# EAGLE design schematic (EAGLE 9.3.0)
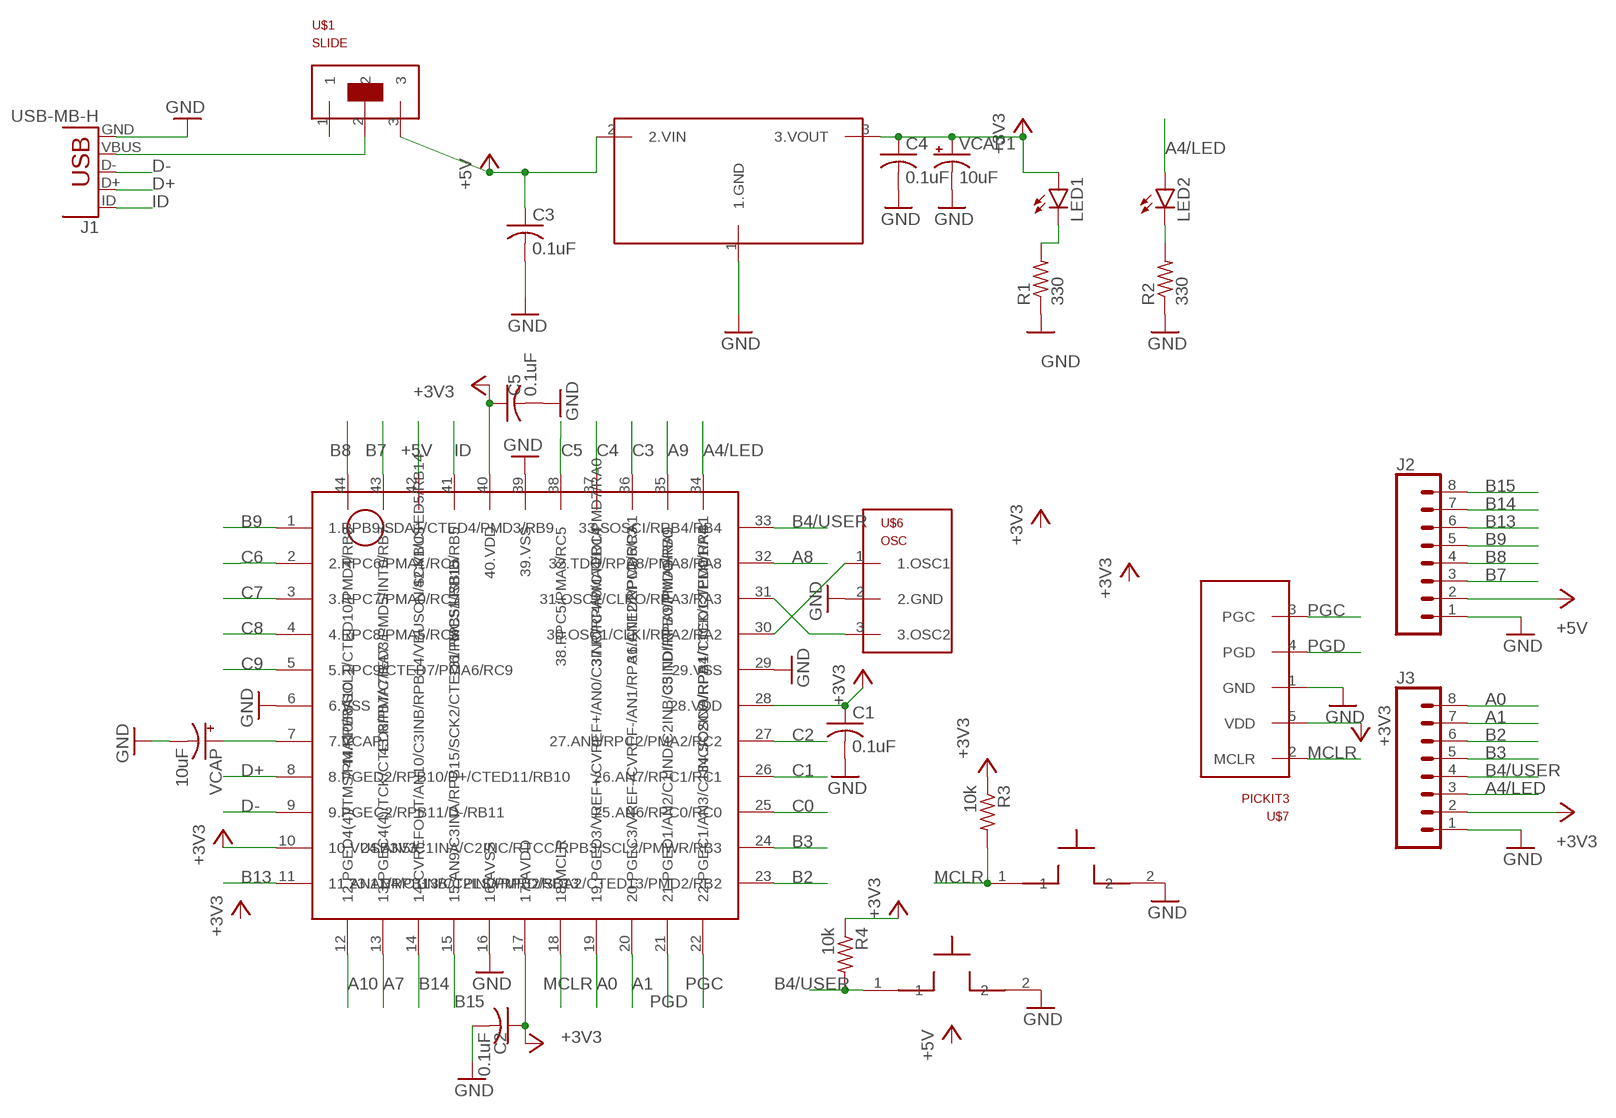
[diagram p0: schematic, sheet 1]

## Parts
C1  0.1uF  C-US025-025X050  [C025-025X050]
C2  0.1uF  C-US025-025X050  [C025-025X050]
C3  0.1uF  C-US025-025X050  [C025-025X050]
C4  0.1uF  C-US025-025X050  [C025-025X050]
C5  0.1uF  C-US025-025X050  [C025-025X050]
J1  USB-MB-H  [USB-MB-H]
J2  CONN_08"  [1X08]
J3  CONN_08"  [1X08]
LED1  LED3MM  [LED3MM]
LED2  LED3MM  [LED3MM]
R1  330  R-US_0207/10  [0207/10]
R2  330  R-US_0207/10  [0207/10]
R3  10k  R-US_0207/10  [0207/10]
R4  10k  R-US_0207/10  [0207/10]
RESET  BUTTON  [BUTTON]
U$1  SLIDE  [SWITCH]
U$2  PIC32MX  [TQFP44]
U$3  TO92VOLTREG  [TO92]
U$6  OSC  [OSC]
U$7  PICKIT3  [1X05]
USER  BUTTON  [BUTTON]
VCAP  10uF  CPOL-USB45181B  [B45181B]
VCAP1  10uF  CPOL-USB45181B  [B45181B]

## Nets
+3V3: C1.1 C2.1 C4.1 C5.1 J3.2 LED1.A R3.1 R4.1 U$2.10(10.VUSB3V3) U$2.17(17.AVDD) U$2.28(28.VDD) U$2.40(40.VDD) U$3.3(3.VOUT) U$7.5(VDD) VCAP1.+
+5V: C3.1 J2.2 U$1.3 U$2.42(42.VBUS) U$3.2(2.VIN)
A0: J3.8 U$2.19(19.PGED3/VREF+/CVREF+/AN0/C3INC/RPA0/CTED1/PMD7/RA0)
A1: J3.7 U$2.20(20.PGEC3/VREF-/CVREF-/AN1/RPA1/CTED2/PMD6/RA1)
A4/LED: J3.3 LED2.A U$2.34(34.SOSCO/RPA4/T1CK/CTED9/RA4)
A7: U$2.13(13.PGEC4(4)/TCK/CTED8/PMA7/RA7)
A8: U$2.32(32.TDO/RPA8/PMA8/RA8)
A9: U$2.35(35.TDI/RPA9/PMA9/RA9)
A10: U$2.12(12.PGED4(4)/TMS/PMA10/RA10)
B2: J3.6 U$2.23(23.AN4/C1INB/C2IND/RPB2/SDA2/CTED13/PMD2/RB2)
B3: J3.5 U$2.24(24.AN5/C1INA/C2INC/RTCC/RPB3/SCL2/PMWR/RB3)
B4/USER: J3.4 R4.2 U$2.33(33.SOSCI/RPB4/RB4) USER.1
B7: J2.3 U$2.43(43.RPB7/CTED3/PMD5/INT0/RB7)
B8: J2.4 U$2.44(44.RPB8/SCL1/CTED10/PMD4/RB8)
B9: J2.5 U$2.1(1.RPB9/SDA1/CTED4/PMD3/RB9)
B13: J2.6 U$2.11(11.AN11/RPB13/CTPLS/PMRD/RB13)
B14: J2.7 U$2.14(14.CVREFOUT/AN10/C3INB/RPB14/VBUSON/SCK1/CTED5/RB14)
B15: J2.8 U$2.15(15.AN9/C3INA/RPB15/SCK2/CTED6/PMCS1/RB15)
C0: U$2.25(25.AN6/RPC0/RC0)
C1: U$2.26(26.AN7/RPC1/RC1)
C2: U$2.27(27.AN8/RPC2/PMA2/RC2)
C3: U$2.36(36.AN12/RPC3/RC3)
C4: U$2.37(37.RPC4/PMA4/RC4)
C5: U$2.38(38.RPC5/PMA3/RC5)
C6: U$2.2(2.RPC6/PMA1/RC6)
C7: U$2.3(3.RPC7/PMA0/RC7)
C8: U$2.4(4.RPC8/PMA5/RC8)
C9: U$2.5(5.RPC9/CTED7/PMA6/RC9)
D+: J1.D+ U$2.8(8.PGED2/RPB10/D+/CTED11/RB10)
D-: J1.D- U$2.9(9.PGEC2/RPB11/D-/RB11)
GND: C1.2 C2.2 C3.2 C4.2 C5.2 J1.GND J2.1 J3.1 R1.1 R2.1 RESET.2 U$2.6(6.VSS) U$2.16(16.AVSS) U$2.29(29.VSS) U$2.39(39.VSS) U$3.1(1.GND) U$6.2(2.GND) U$7.1(GND) USER.2 VCAP1.- VCAP.-
ID: J1.ID(D+1) U$2.41(31.RPB5/USBID/RB5)
MCLR: R3.2 RESET.1 U$2.18(18.MCLR) U$7.2(MCLR)
N$1: J1.VBUS U$1.2
N$2: LED1.K(C) R1.2
N$3: U$2.30(30.OSC1/CLKI/RPA2/RA2) U$6.1(1.OSC1)
N$4: U$2.31(31.OSC2/CLKO/RPA3/RA3) U$6.3(3.OSC2)
N$6: U$2.7(7.VCAP) VCAP.+
N$18: LED2.K(C) R2.2
PGC: U$2.22(22.PGEC1/AN3/C1INC/C2INA/RPB1/CTED12/PMD1/RB1) U$7.3(PGC)
PGD: U$2.21(21.PGED1/AN2/C1IND/C2INB/C3IND/RPB0/PMD0/RB0) U$7.4(PGD)
Unconnected: U$1.1

## Library data of the parts
C1-C5 = library:C-US: CAPACITOR, American symbol; SPICEPREFIX: C
J1 = library:USB: USB Connectors USB-B-PTH is fully proven SKU : PRT-00139/CONN-08278 USB-miniB is fully proven SKU : PRT-00587 USB-A-PCB is untested. USB-A-H is throughly reviewed, but untested. Spark Fun Electronics SKU : PRT-00437 USB-B-SMT is throughly reviewed, but untested. Needs silkscreen touching up. USB-A-S has not been used/tested USB-MB-H has not been used/tested USB-MICROB has been used. CONN-09505
J2 J3 = library:CONN_08: Multi connection point. Often used as Generic Header-pin footprint for 0.1 inch spaced/style header connections On any of the 0.1 inch spaced packages, you can populate with these: Break Away Headers - Straight <https://www.sparkfun.com/products/116> (PRT-00116) Break Away Male Headers - Right Angle <https://www.sparkfun.com/products/553> (PRT-00553) Female Headers <https://www.sparkfun.com/products/115> (PRT-00115) Break Away Headers - Machine Pin <https://www.sparkfun.com/products/117> (PRT-00117) Break Away Female Headers - Swiss Machine Pin <https://www.sparkfun.com/products/743> (PRT-00743) Arduino Stackable Header - 8 Pin <https://www.sparkfun.com/products/9279> (PRT-09279) For SCREWTERMINALS and SPRING TERMINALS visit here: Screw Terimnals on SparkFun.com <https://www.sparkfun.com/search/results?term=Screw+Terminals> (5mm/3.5mm/2.54mm spacing) This device is also useful as a general connection point to wire up your design to another part of your project. Our various solder wires solder well into these plated through hole pads. Hook-Up Wire - Assortment (Stranded, 22 AWG) <https://www.sparkfun.com/products/11375> (PRT-11375) Hook-Up Wire - Assortment (Solid Core, 22 AWG) <https://www.sparkfun.com/products/11367> (PRT-11367) View the entire wire category on our website here <https://www.sparkfun.com/categories/141> Special notes: Molex polarized connector foot print use with SKU : PRT-08231 with associated crimp pins and housings. 1MM SMD Version SKU: PRT-10208 NOTES ON THE VARIANTS LOCK and LOCK_LONGPADS... This footprint was designed to help hold the alignment of a through-hole component (i.e. 6-pin header) while soldering it into place. You may notice that each hole has been shifted either up or down by 0.005 of an inch from it's more standard position (which is a perfectly straight line). This slight alteration caused the pins (the squares in the middle) to touch the edges of the holes. Because they are alternating, it causes a "brace" to hold the component in place. 0.005 has proven to be the perfect amount of "off-center" position when using our standard breakaway headers. Although looks a little odd when you look at the bare footprint, once you have a header in there, the alteration is very hard to notice. Also,if you push a header all the way into place, it is covered up entirely on the bottom side.; PROD_ID: CONN-08438
LED1 LED2 = library:LED: LED OSRAM: - CHIPLED LG R971, LG N971, LY N971, LG Q971, LY Q971, LO R971, LY R971 LH N974, LH R974 LS Q976, LO Q976, LY Q976 LO Q996 - Hyper CHIPLED LW Q18S LB Q993, LB Q99A, LB R99A - SideLED LS A670, LO A670, LY A670, LG A670, LP A670 LB A673, LV A673, LT A673, LW A673 LH A674 LY A675 LS A676, LA A676, LO A676, LY A676, LW A676 LS A679, LY A679, LG A679 - Hyper Micro SIDELED® LS Y876, LA Y876, LO Y876, LY Y876 LT Y87S - SmartLED LW L88C, LW L88S LB L89C, LB L89S, LG L890 LS L89K, LO L89K, LY L89K LS L896, LA L896, LO L896, LY L896 - TOPLED LS T670, LO T670, LY T670, LG T670, LP T670 LSG T670, LSP T670, LSY T670, LOP T670, LYG T670 LG T671, LOG T671, LSG T671 LB T673, LV T673, LT T673, LW T673 LH T674 LS T676, LA T676, LO T676, LY T676, LB T676, LH T676, LSB T676, LW T676 LB T67C, LV T67C, LT T67C, LS T67K, LO T67K, LY T67K, LW E67C LS E67B, LA E67B, LO E67B, LY E67B, LB E67C, LV E67C, LT E67C LW T67C LS T679, LY T679, LG T679 LS T770, LO T770, LY T770, LG T770, LP T770 LB T773, LV T773, LT T773, LW T773 LH T774 LS E675, LA E675, LY E675, LS T675 LS T776, LA T776, LO T776, LY T776, LB T776 LHGB T686 LT T68C, LB T68C - Hyper Mini TOPLED® LB M676 - Mini TOPLED Santana® LG M470 LS M47K, LO M47K, LY M47K Source: http://www.osram.convergy.de LUXEON: - LUMILED® LXK2-PW12-R00, LXK2-PW12-S00, LXK2-PW14-U00, LXK2-PW14-V00 LXK2-PM12-R00, LXK2-PM12-S00, LXK2-PM14-U00 LXK2-PE12-Q00, LXK2-PE12-R00, LXK2-PE12-S00, LXK2-PE14-T00, LXK2-PE14-U00 LXK2-PB12-K00, LXK2-PB12-L00, LXK2-PB12-M00, LXK2-PB14-N00, LXK2-PB14-P00, LXK2-PB14-Q00 LXK2-PR12-L00, LXK2-PR12-M00, LXK2-PR14-Q00, LXK2-PR14-R00 LXK2-PD12-Q00, LXK2-PD12-R00, LXK2-PD12-S00 LXK2-PH12-R00, LXK2-PH12-S00 LXK2-PL12-P00, LXK2-PL12-Q00, LXK2-PL12-R00 Source: www.luxeon.com KINGBRIGHT: KA-3528ASYC Source: www.kingbright.com
R1-R4 = library:R-US_: RESISTOR, American symbol; SPICEPREFIX: R
RESET USER = library:BUTTON
U$1 = library:SLIDE
U$2 = library:PIC32MX
U$3 = library:TO92VOLTREG
U$6 = library:OSC
U$7 = library:PICKIT3
VCAP VCAP1 = library:CPOL-US: POLARIZED CAPACITOR, American symbol; SPICEPREFIX: C

## Board
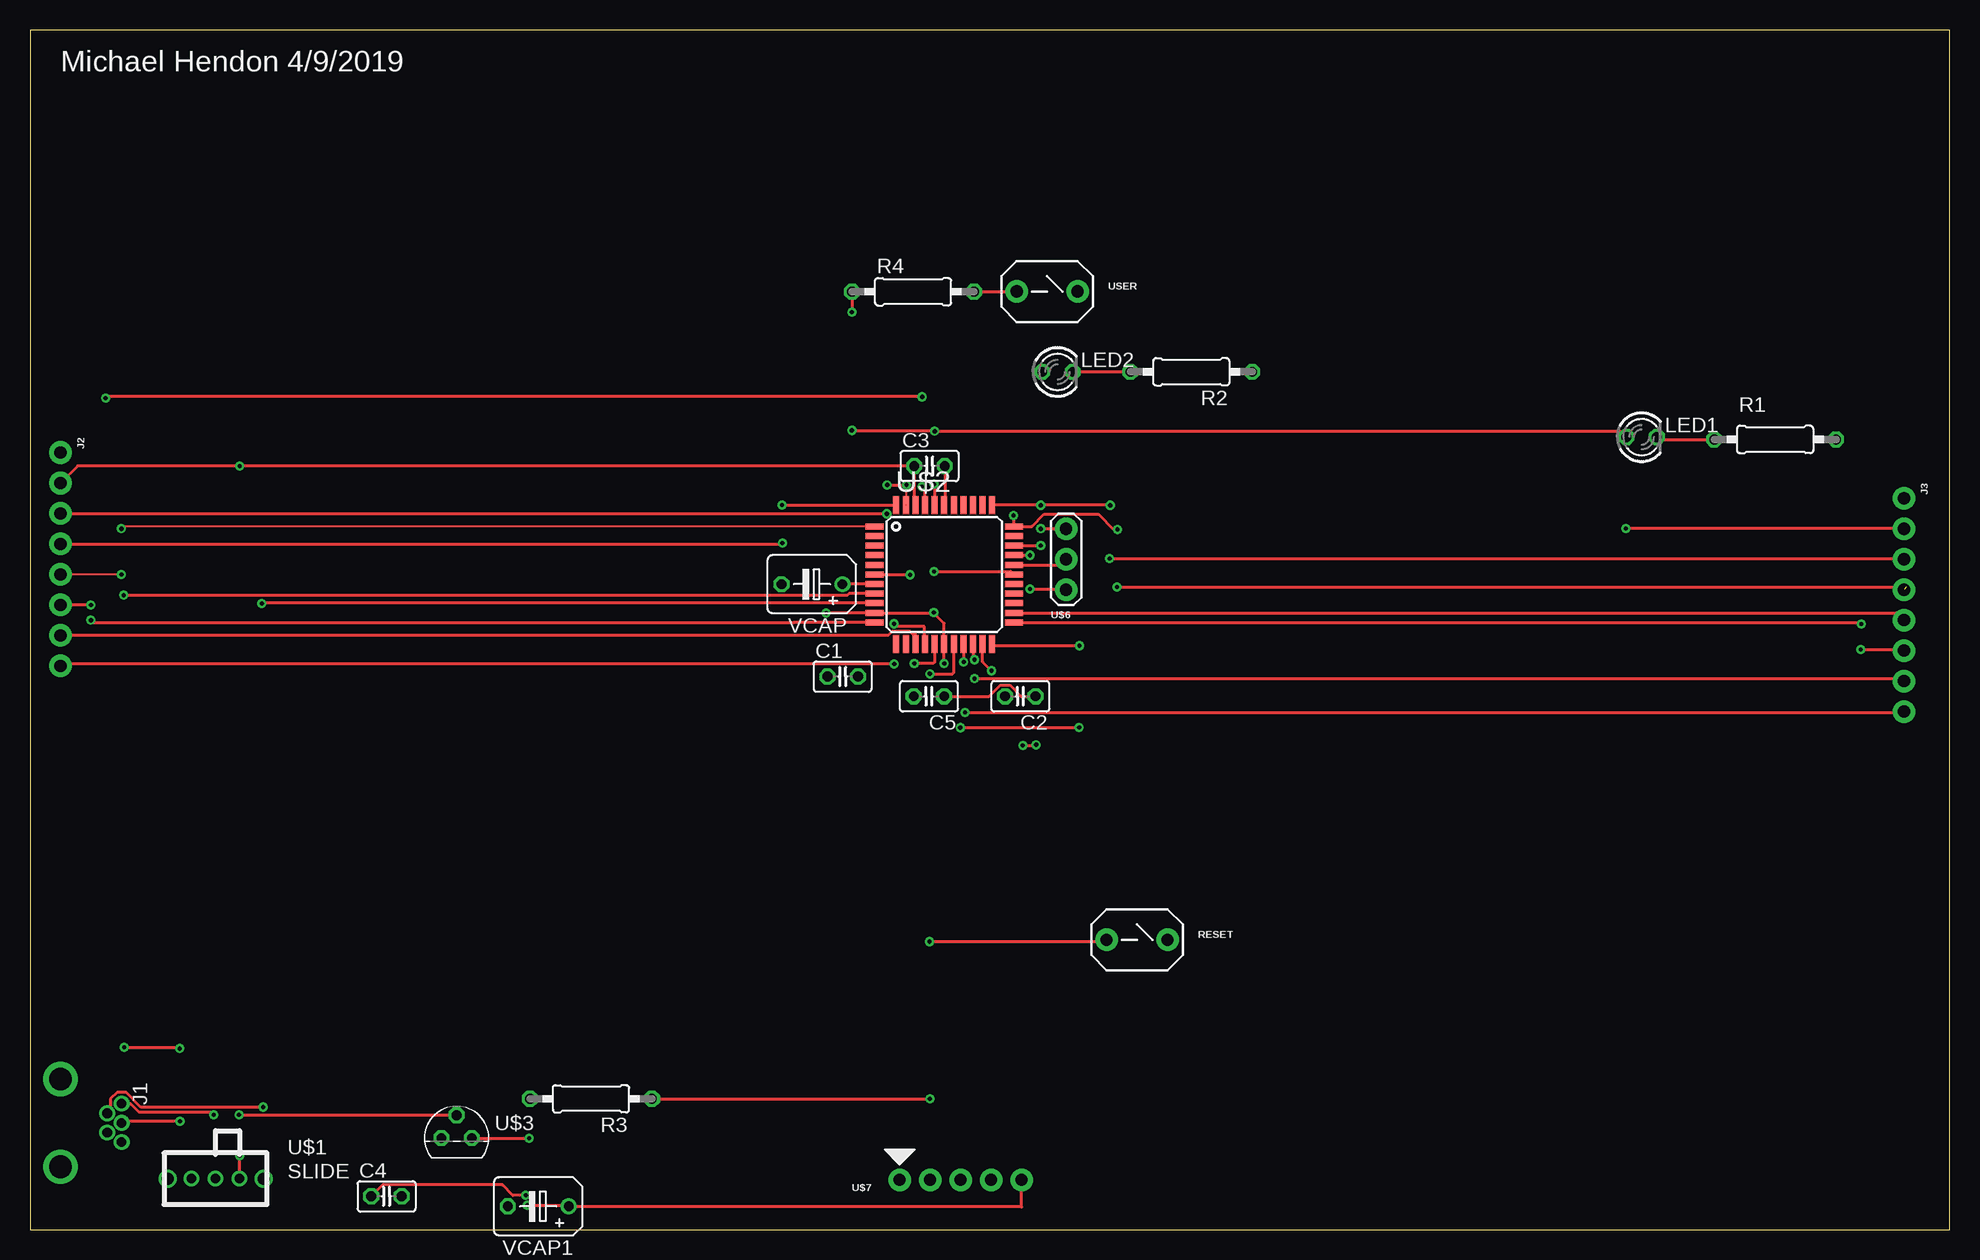
[diagram p1: board, top side]
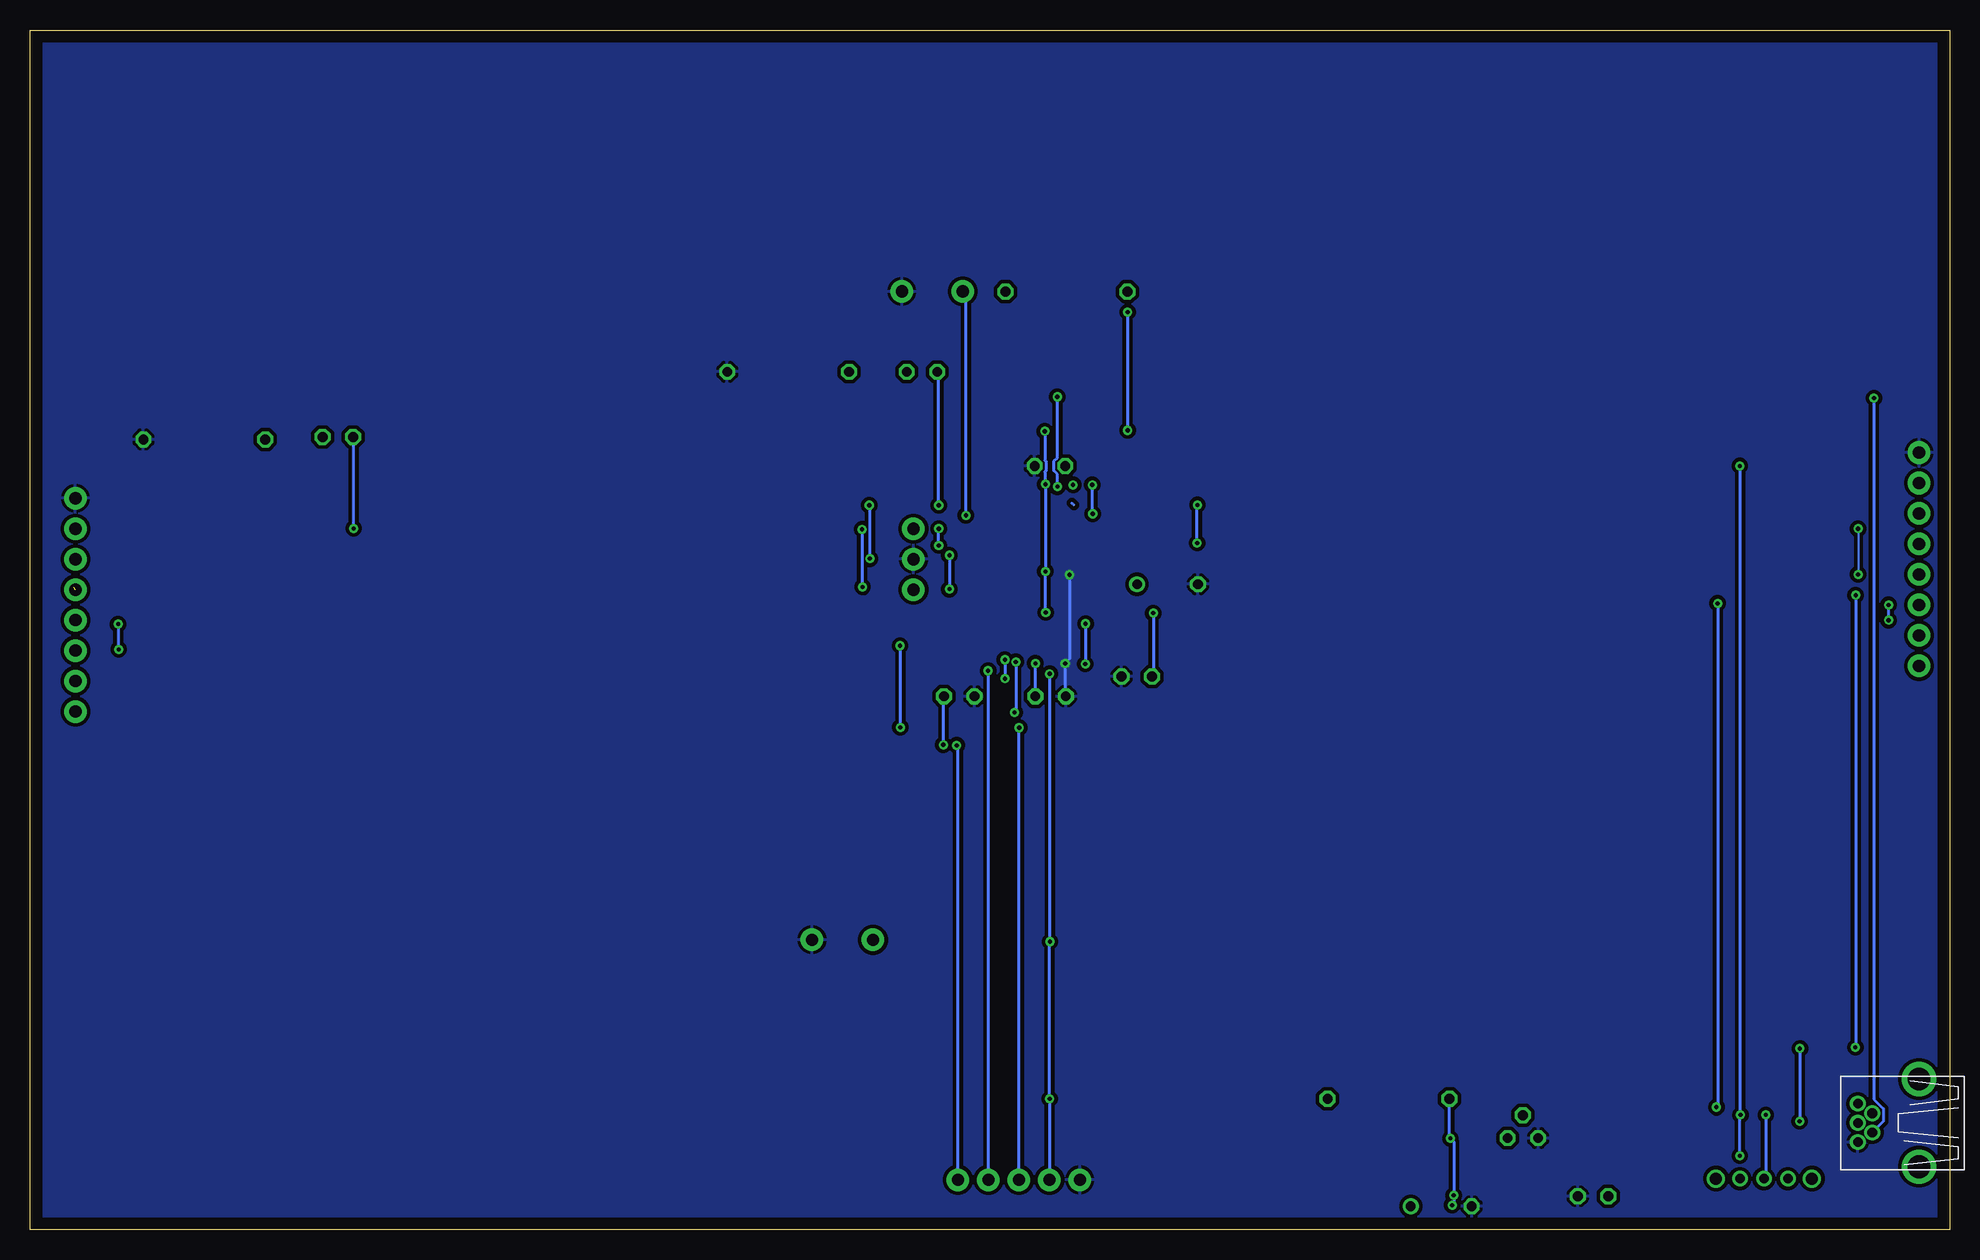
[diagram p2: board, bottom side, seen from below]

Size 160 x 100 mm. Coordinates in mm from the lower left corner, seen from the top.
Outline: 0,0 160,0 160,100 0,100 0,0
Copper layers (1*16): Top 0.035mm / dielectric 1.5mm / Bottom 0.035mm
Design rules "default": minimum track width 6mil, minimum drill 0.35mm, track to track 6mil, track to pad 6mil, pad to pad 6mil, via to via 6mil, smd to smd 6mil, copper to edge 40mil, drill to drill 6mil, minimum pad ring 10mil, minimum via ring 8mil, stop-mask expansion 4mil, vias tented up to drill 0mil, thermal gap 10mil

### Footprints (pad centres in the part's own frame; a part is rotated, then mirrored left to right if it is on the bottom)
C025-025X050 = drill 0.813 octagon: 1 -1.27,0; 2 1.27,0
USB-MB-H = drill 0.8: D+ 5.1,0; D- 3.9,0.8; GND 5.1,-1.6; ID 3.9,-0.8; VBUS 5.1,1.6 | drill 1.9: P$6 0,-3.65; P$7 0,3.65
1X08 = drill 1.016 pad 1.88: 1 0,0; 2 2.54,0; 3 5.08,0; 4 7.62,0; 5 10.16,0; 6 12.7,0; 7 15.24,0; 8 17.78,0
LED3MM = drill 0.813 octagon: A -1.27,0; K 1.27,0
0207/10 = drill 0.813 octagon: 1 -5.08,0; 2 5.08,0
BUTTON = drill 1.016 pad 1.88: 1 -2.54,0; 2 2.54,0
SWITCH = drill 0.8: 1 -2,0; 2 0,0; 3 2,0 | drill 1: P$1 -4,0; P$2 4,0
TQFP44 = smd 1.5 x 0.5: 1 -5.8,4; 2 -5.8,3.2; 3 -5.8,2.4; 4 -5.8,1.6; 5 -5.8,0.8; 6 -5.8,0; 7 -5.8,-0.8; 8 -5.8,-1.6; 9 -5.8,-2.4; 10 -5.8,-3.2; 11 -5.8,-4; 23 5.8,-4; 24 5.8,-3.2; 25 5.8,-2.4; 26 5.8,-1.6; 27 5.8,-0.8; 28 5.8,0; 29 5.8,0.8; 30 5.8,1.6; 31 5.8,2.4; 32 5.8,3.2; 33 5.8,4 | smd 0.5 x 1.5: 12 -4,-5.8; 13 -3.2,-5.8; 14 -2.4,-5.8; 15 -1.6,-5.8; 16 -0.8,-5.8; 17 0,-5.8; 18 0.8,-5.8; 19 1.6,-5.8; 20 2.4,-5.8; 21 3.2,-5.8; 22 4,-5.8; 34 4,5.8; 35 3.2,5.8; 36 2.4,5.8; 37 1.6,5.8; 38 0.8,5.8; 39 0,5.8; 40 -0.8,5.8; 41 -1.6,5.8; 42 -2.4,5.8; 43 -3.2,5.8; 44 -4,5.8
TO92 = drill 0.813 octagon: 1 -1.27,0; 2 0,1.905; 3 1.27,0
OSC = drill 1.016 pad 1.88: 1 -2.54,0; 2 0,0; 3 2.54,0
1X05 = drill 1.016 pad 1.88: 1 0,0; 2 2.54,0; 3 5.08,0; 4 7.62,0; 5 10.16,0
B45181B = drill 0.813: + -2.54,0 | drill 0.813 octagon: - 2.54,0

### Placement (x,y rotation side)
C1  67.74,46.1 0 top
C2  82.55,44.45 180 top
C3  74.98,63.65 0 top
C4  29.72,2.77 0 top
C5  74.93,44.45 180 top
J1  2.54,8.89 0 top
J2  2.54,64.77 270 top
J3  156.21,60.96 270 top
LED1  134.34,66.07 0 top
LED2  85.65,71.5 0 top
R1  145.47,65.86 180 top
R2  96.8,71.5 180 top
R3  46.76,10.9 0 top
R4  73.61,78.18 0 top
RESET  92.28,24.16 0 top
U$1  15.47,4.24 0 top
U$2  76.2,54.61 0 top
U$3  35.56,7.62 0 top
U$6  86.36,55.88 90 top
U$7  72.49,4.14 0 top
USER  84.79,78.21 0 top
VCAP  65.18,53.8 180 top
VCAP1  42.37,1.93 180 top

### Tracks (layer width: path | path; a pad name or v marks a point on that pad's centre or on a via)
+3V3  (via drill 0.35)
  Top 0.254: R4.1 68.53,76.48 68.5,76.45 v68.5,76.48 | v68.5,66.62 75.39,66.62 75.41,66.6 v75.41,66.55 132.59,66.55 LED1.A | v75.36,62.13 75.4,62.09 U$2.40 | J3.2 133.04,58.42 133.02,58.4 v133.02,58.45 | U$3.3 41.63,7.62 | 41.66,7.62 41.63,7.62 | 41.63,7.62 v41.6,7.59 | v41.45,2.03 44.81,2.03 VCAP1.+ 82.58,1.93 82.65,1.85 U$7.5 | v41.33,2.85 40.24,2.85 39.38,3.71 29.39,3.71 C4.1 | v82.75,40.36 83.97,40.36 | 83.97,40.36 84,40.34 | 83.97,40.36 83.92,40.41 v83.87,40.41 | C5.1 79.95,44.45 80.89,45.39 81.67,45.39 82.61,44.45 C2.1 | v76.2,47.19 U$2.17 76.2,50.52 75.31,51.41 | v75.36,54.86 81.75,54.86 U$2.28 | 75.31,51.41 U$2.10 70.37,51.38 v66.37,51.38 | 75.31,51.41 v75.34,51.44
  Bottom 0.254: v68.5,76.48 68.5,66.67 68.48,66.65 v68.5,66.62 | v75.41,66.55 75.41,64.14 75.31,64.04 75.31,63.26 75.41,63.16 75.41,62.13 v75.36,62.13 v75.36,54.86 75.34,54.84 v75.34,51.44 | v133.02,58.45 133.02,66.02 LED1.A | R3.1 41.68,7.67 v41.6,7.59 41.33,7.32 v41.33,2.85 41.33,1.98 41.4,1.98 v41.45,2.03 | U$7.5 82.65,40.39 82.83,40.56 82.83,40.44 v82.75,40.36 | v83.87,40.41 83.87,44.4 C2.1 | C5.1 76.2,47.17 76.22,47.19 v76.2,47.19 | v66.37,51.38 66.37,46.2 C1.1
+5V  (via drill 0.35)
  Top 0.254: U$2.42 73.69,60.52 73.69,61.78 73.71,61.8 C3.1 17.6,63.65 v17.48,63.65 3.96,63.65 J2.2 | U$1.3 17.47,5.79 17.48,5.79 v17.48,6.15 | v17.42,9.55 35.53,9.55 U$3.2
  Bottom 0.254: v17.48,6.15 17.48,9.47 17.5,9.5 17.45,9.55 v17.42,9.55 17.42,63.6 v17.48,63.65
A0  (via drill 0.35)
  Top 0.254: U$2.19 77.8,47.47 77.83,47.45 v77.83,47.32 | v77.93,43.1 156.13,43.1 J3.8
  Bottom 0.254: v77.83,47.32 77.83,43.26 78.11,42.98 78.05,42.98 v77.93,43.1
A1  (via drill 0.35)
  Top 0.254: U$2.20 78.6,47.64 78.64,47.6 78.64,47.59 v78.73,47.5 | v78.74,45.92 156.01,45.92 J3.7
  Bottom 0.254: v78.73,47.5 78.73,45.97 78.72,45.95 v78.74,45.92
A4/LED  (via drill 0.35)
  Top 0.254: U$2.34 80.24,60.45 84.3,60.45 84.3,60.43 84.26,60.39 | 84.26,60.39 v84.25,60.38 | J3.3 90.09,55.88 89.99,55.98 v89.99,55.93 | v90.04,60.38 84.28,60.38 84.26,60.39
  Bottom 0.254: v84.25,60.38 84.25,71.37 LED2.A | v89.99,55.93 89.99,60.35 90.02,60.38 v90.04,60.38
B2  (via drill 0.35)
  Top 0.254: U$2.23 152.54,50.61 152.65,50.49 v152.65,50.47 | v152.6,48.36 156.11,48.36 J3.6
  Bottom 0.254: v152.65,50.47 152.65,48.44 152.73,48.36 v152.6,48.36
B3
  Top 0.254: U$2.24 155.6,51.41 J3.5
B4/USER  (via drill 0.35)  (1 unrouted)
  Top 0.254: v81.99,59.54 82.02,59.51 82,59.5 U$2.33 83.51,58.61 84.54,59.64 89.05,59.64 90.32,58.37 v90.65,58.37 | R4.2 82.22,78.18 USER.1 | v90.6,53.57 156.41,53.57 156.74,53.24
  Bottom 0.254: v81.99,59.54 81.99,77.95 USER.1 | v90.65,58.37 90.65,53.49 90.6,53.44 | 90.47,53.31 90.6,53.44 | 90.6,53.44 v90.6,53.57
B7  (via drill 0.35)  (1 unrouted)
  Top 0.152: v73.05,62.08 73,62.03 U$2.43
  Top 0.254: J2.3 71.4,59.69 v71.42,59.67 v71.42,59.66 | v71.45,62.08 v73.05,62.08
  Bottom 0.254: v71.42,59.66 71.42,62.06 71.4,62.08 v71.45,62.08 | v73.05,62.08 73.15,61.98 | 73.15,60.56 U$2.43
B8  (via drill 0.35)
  Top 0.254: J2.4 62.61,57.15 62.69,57.23 v62.71,57.23 | v62.69,60.4 U$2.44
  Bottom 0.254: v62.71,57.23 62.71,60.38 v62.69,60.4
B9  (via drill 0.35)
  Top 0.152: U$2.1 7.62,58.61 v7.62,58.42 | v7.62,54.61 J2.5
  Bottom 0.152: v7.62,58.42 v7.62,54.61
B13  (via drill 0.35)
  Top 0.254: U$2.11 66.24,50.61 65.08,50.61 | v5.08,52.07 J2.6 | v5.08,50.8 5.08,50.61 63.68,50.61 65.08,50.61 | 65.08,50.61
  Bottom 0.254: v5.08,50.8 v5.08,52.07
B14
  Top 0.254: U$2.14 73.8,49.65 | 73.8,49.65 73.81,49.66 | 73.8,49.65 73.69,49.53 73.67,49.53 73.37,49.84 71.83,49.84 71.53,49.53 J2.7
B15  (via drill 0.35)
  Top 0.254: U$2.15 74.55,48.86 74.55,50.27 72.08,50.27 71.98,50.37 71.98,50.47 v72.01,50.5 | v72.03,47.14 2.69,47.14 J2.8
  Bottom 0.254: v72.01,50.5 72.01,47.17 v72.03,47.14
D+  (via drill 0.35)
  Top 0.254: U$2.8 68.26,53.01 68.11,52.86 7.95,52.86 7.82,52.98 | 7.77,53.03 7.82,52.98 | 7.82,52.98 v7.82,52.88 | v7.85,15.19 12.5,15.19 12.5,15.11 v12.47,15.09 | v12.5,9.02 7.77,9.02 J1.D+
  Bottom 0.254: v7.82,52.88 7.82,15.32 7.85,15.29 v7.85,15.19 | v12.47,15.09 12.47,8.97 12.5,8.99 v12.5,9.02
D-  (via drill 0.35)
  Top 0.254: U$2.9 19.37,52.21 19.3,52.15 19.3,52.17 v19.33,52.2 | v19.43,10.21 9.24,10.21 8.03,11.42 7.25,11.42 6.71,10.88 6.71,9.96 J1.D-
  Bottom 0.254: v19.33,52.2 19.33,10.03 19.46,9.91 19.46,10.18 v19.43,10.21
GND  (via drill 0.35)
  Top 0.254: C3.2 76.25,60.46 U$2.39 | U$2.29 85.89,55.41 U$6.2 | U$2.16 75.4,47.31 | 75.4,47.31 75.41,47.3 | 75.4,47.31 75.29,47.19 v73.71,47.19 | U$2.6 73.36,54.61 73.38,54.59 v73.36,54.59
  Bottom 0.254: C5.2 73.71,44.5 v73.71,47.19 73.36,47.55 v73.36,54.59
  pour Bottom (isolate 0.305): 160.02,100.33 160.02,0 0,0 0,100.33
ID  (via drill 0.35)
  Top 0.254: U$2.41 74.6,61.54 74.32,61.82 74.32,61.88 v74.37,61.92 | v74.37,69.42 6.43,69.42 6.25,69.24 6.25,69.27 v6.3,69.32
  Bottom 0.254: 74.4,69.42 74.37,69.39 74.37,64.33 74.65,64.04 74.65,63.26 74.37,62.98 v74.37,61.92 | 74.42,69.44 74.4,69.42 | 74.4,69.42 v74.37,69.42 | v6.3,69.32 6.3,10.87 5.51,10.08 5.51,9.02 J1.ID
MCLR  (via drill 0.35)
  Top 0.254: R3.2 74.88,10.9 75.01,11.02 v75.01,10.9 | v74.98,24 89.59,24 RESET.1 | v75.01,46.33 76.86,46.33 76.89,46.3 77,46.42 U$2.18
  Bottom 0.254: U$7.2 75.03,10.87 v75.01,10.9 75.01,24.08 74.98,24.11 v74.98,24 74.98,46.33 75.01,46.35 v75.01,46.33
N$1  (via drill 0.35)
  Top 0.254: J1.VBUS 8.38,10.49 9.07,9.8 15.34,9.8 15.34,9.58 v15.32,9.55
  Bottom 0.254: v15.32,9.55 15.32,4.39 U$1.2
N$2
  Top 0.254: LED1.K 135.81,65.86 R1.2
N$3  (via drill 0.35)
  Top 0.254: U$2.30 83.21,56.21 | 83.21,56.21 | 83.21,56.21 v83.36,56.21 | U$6.1 83.41,53.34 v83.36,53.39
  Bottom 0.254: v83.36,56.21 v83.36,53.39 83.36,53.37 83.34,53.34
N$4  (via drill 0.35)
  Top 0.254: U$2.31 v84.24,57.01 84.25,57 v84.25,57.02 | v84.25,58.42 U$6.3
  Bottom 0.254: v84.25,57.02 84.25,58.37 84.23,58.4 v84.25,58.42
N$6
  Top 0.254: U$2.7 VCAP.+
N$18
  Top 0.254: LED2.K R2.2
PGC  (via drill 0.35)
  Top 0.254: v77.55,41.83 87.55,41.83 87.58,41.86 v87.45,41.86 | v87.48,48.67 80.34,48.67 U$2.22
  Bottom 0.254: U$7.3 77.57,41.78 77.52,41.83 v77.55,41.83 | v87.45,41.86 87.45,48.72 87.48,48.74 v87.48,48.67
PGD  (via drill 0.35)
  Top 0.254: v80.14,46.58 79.4,47.32 U$2.21
  Bottom 0.254: U$7.4 80.11,46.41 80.14,46.43 v80.14,46.58

### Text on the board
tPlace: Michael Hendon 4/9/2019